# EAGLE design untitled (EAGLE 8.6.3)
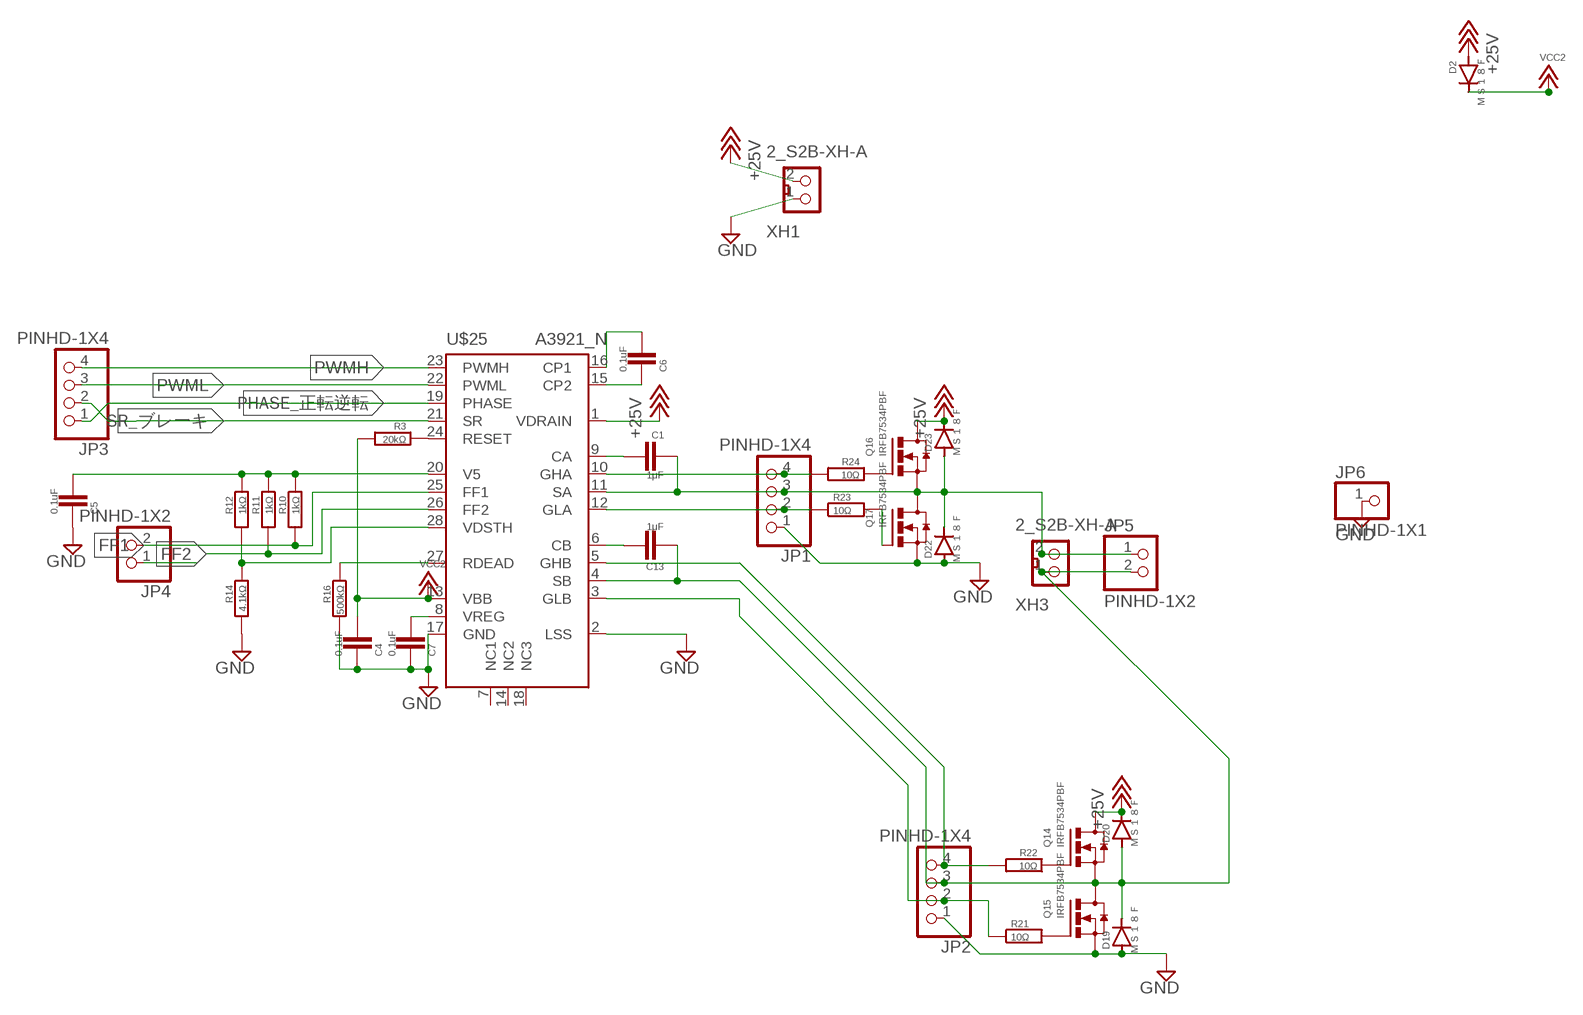
[diagram p0: schematic, sheet 1]

## Parts
C1  1μF  CAPACITOR>>2012  [2012]
C4  0.1uF  CAPACITOR>>2012  [2012]
C5  0.1uF  CAPACITOR>>2012  [2012]
C6  0.1uF  CAPACITOR>>2012  [2012]
C7  0.1uF  CAPACITOR>>2012  [2012]
C13  1μF  CAPACITOR>>2012  [2012]
D2  ＭＳ１８Ｆ  DIODE>>MS18F  [MS18F]
D19  ＭＳ１８Ｆ  DIODE>>MS18F  [MS18F]
D20  ＭＳ１８Ｆ  DIODE>>MS18F  [MS18F]
D22  ＭＳ１８Ｆ  DIODE>>MS18F  [MS18F]
D23  ＭＳ１８Ｆ  DIODE>>MS18F  [MS18F]
JP1  PINHD-1X4  [1X04]
JP2  PINHD-1X4  [1X04]
JP3  PINHD-1X4  [1X04]
JP4  PINHD-1X2  [1X02]
JP5  PINHD-1X2  [1X02]
JP6  PINHD-1X1  [1X01]
Q14  IRFB7534PBF  MOSFET_N>>TO252  [TO252]
Q15  IRFB7534PBF  MOSFET_N>>TO252  [TO252]
Q16  IRFB7534PBF  MOSFET_N>>TO252  [TO252]
Q17  IRFB7534PBF  MOSFET_N>>TO252  [TO252]
R3  20kΩ  REGISTER>>2012  [2012]
R10  1kΩ  REGISTER>>2012  [2012]
R11  1kΩ  REGISTER>>2012  [2012]
R12  1kΩ  REGISTER>>2012  [2012]
R14  4.1kΩ  REGISTER>>2012  [2012]
R16  500kΩ  REGISTER>>2012  [2012]
R21  10Ω  REGISTER>>2012  [2012]
R22  10Ω  REGISTER>>2012  [2012]
R23  10Ω  REGISTER>>2012  [2012]
R24  10Ω  REGISTER>>2012  [2012]
U$25  A3921_N  [TSSOP28_N]
XH1  2_S2B-XH-A  [S2B-XH-A]
XH3  2_S2B-XH-A  [S2B-XH-A]

## Nets
+18V: D2.P$1(A) D20.P$2(C) D23.P$2(C) Q14.3(D) Q16.3(D) U$25.1(VDRAIN) XH1.2 ; supply symbol labelled +25V
FF1: JP4.2 R10.2 U$25.25(FF1)
FF2: JP4.1 R11.2 U$25.26(FF2)
GND: C4.2 C5.2 C7.2 D19.P$1(A) D22.P$1(A) JP1.1 JP2.1 JP6.1 Q15.2(S) Q17.2(S) R14.2 R16.2 U$25.2(LSS) U$25.17(GND) XH1.1
N$4: C6.1 U$25.16(CP1)
N$5: JP2.4 R22.2 U$25.5(GHB)
N$7: C1.2 D22.P$2(C) D23.P$1(A) JP1.3 JP5.1 Q16.2(S) Q17.3(D) U$25.11(SA) XH3.2
N$8: JP2.2 R21.1 U$25.3(GLB)
N$14: C1.1 U$25.9(CA)
N$16: JP1.4 R24.2 U$25.10(GHA)
N$19: C13.2 D19.P$2(C) D20.P$1(A) JP2.3 JP5.2 Q14.2(S) Q15.3(D) U$25.4(SB) XH3.1
N$29: C6.2 U$25.15(CP2)
N$35: JP1.2 R23.1 U$25.12(GLA)
N$36: R3.1 U$25.24(RESET)
N$37: C7.1 U$25.8(VREG)
N$41: C13.1 U$25.6(CB)
N$43: R12.2 R14.1 U$25.28(VDSTH)
N$50: Q15.1(G) R21.2
N$51: R16.1 U$25.27(RDEAD)
N$54: Q14.1(G) R22.1
N$56: Q17.1(G) R23.2
N$60: Q16.1(G) R24.1
PHASE_正転逆転: JP3.1 U$25.19(PHASE)
PWMH: JP3.4 U$25.23(PWMH)
PWML: JP3.3 U$25.22(PWML)
SR_ブレーキ: JP3.2 U$25.21(SR)
V5: C5.1 R10.1 R11.1 R12.1 U$25.20(V5)
VCC2: C4.1 D2.P$2(C) R3.2 U$25.13(VBB)
Unconnected: U$25.7(NC1) U$25.14(NC2) U$25.18(NC3)

## Library data of the parts
C1 C4-C7 C13 = !SMD:CAPACITOR>>
D2 D19 D20 D22 D23 = !diode:DIODE>>: DIODE
JP1-JP3 = !pinhead(ﾋﾟﾝﾍｯﾀﾞ):PINHD-1X4: PIN HEADER
JP4 JP5 = !pinhead(ﾋﾟﾝﾍｯﾀﾞ):PINHD-1X2: PIN HEADER
JP6 = !pinhead(ﾋﾟﾝﾍｯﾀﾞ):PINHD-1X1: PIN HEADER
Q14-Q17 = !FET_transister_v-reg:MOSFET_N>>
R3 R10-R12 R14 R16 R21-R24 = !SMD:REGISTER>>
U$25 = !irs(GateDriver):A3921_N
XH1 XH3 = !con-xh:2_: Wire-to-Board 2.5mm pitch top mount connector Source: http://www.jst-mfg.com/product/pdf/jpn/XH.pdf http://www.jst-mfg.com/product/detail.php?series=277

## Board
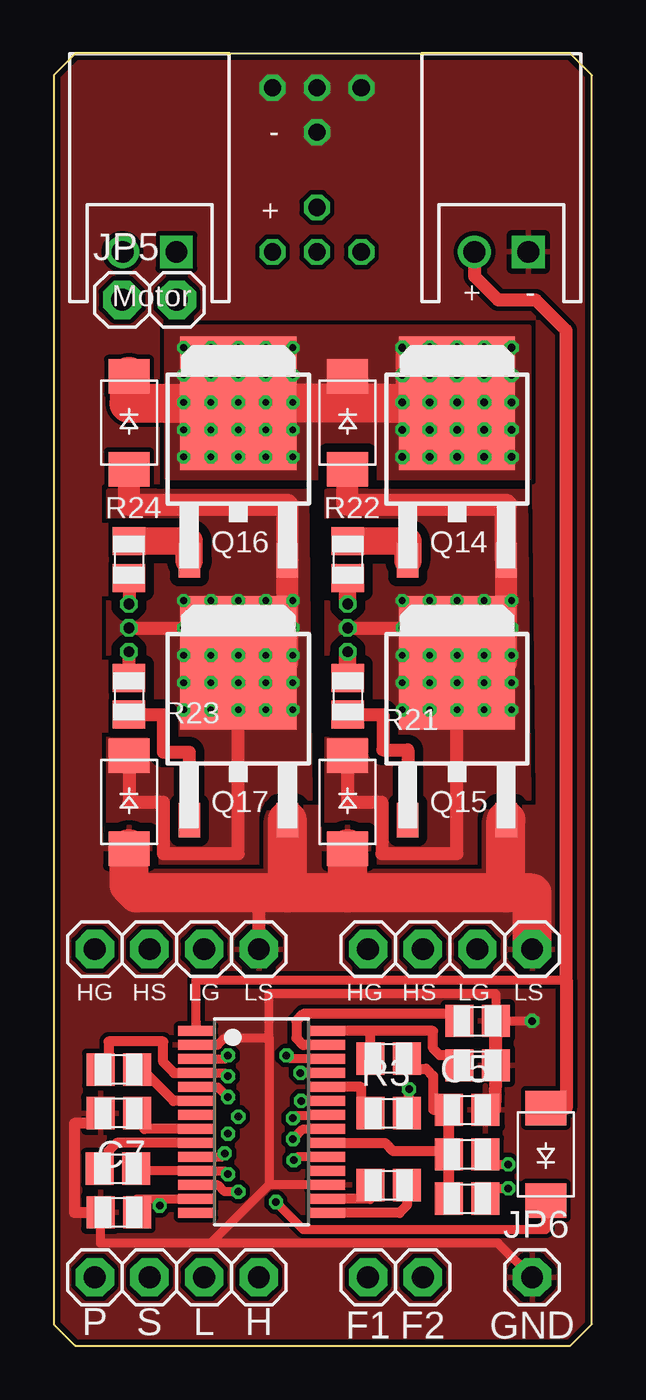
[diagram p1: board, top side]
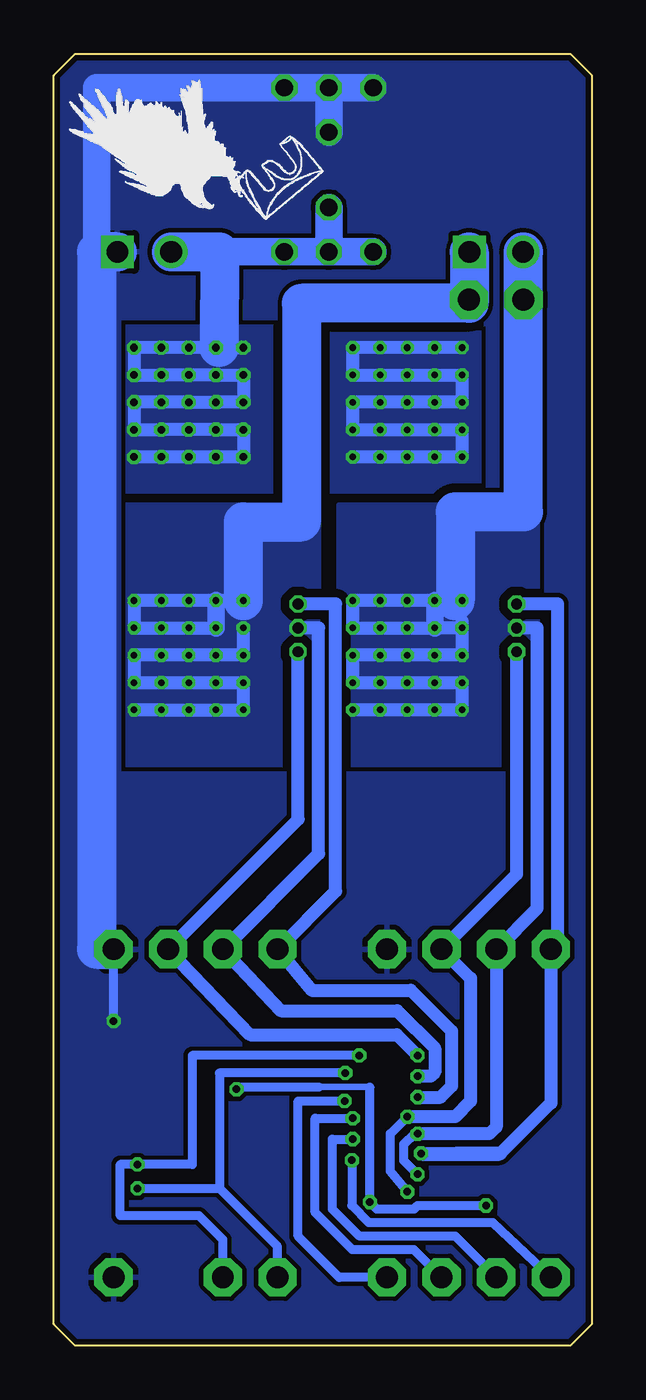
[diagram p2: board, bottom side, seen from below]

Size 25 x 60 mm. Coordinates in mm from the lower left corner, seen from the top.
Outline: 25,1 25,59 24,60 1,60 0,59 0,1 1,0 24,0 25,1
Copper layers (1*16): Top 0.035mm / dielectric 1.5mm / Bottom 0.035mm
Design rules "SeeedStudio_2layer_DRU_no_angle_20140221": minimum track width 6mil, minimum drill 12mil, track to track 6mil, track to pad 6mil, pad to pad 6mil, via to via 6mil, smd to smd 0mil, copper to edge 10mil, drill to drill 10mil, minimum pad ring 10mil, minimum via ring 6mil, stop-mask expansion 2mil, vias tented up to drill 100mil, thermal gap 10mil

### Footprints (pad centres in the part's own frame; a part is rotated, then mirrored left to right if it is on the bottom)
2012 = smd 1.3 x 1.5: 1 -0.85,0; 2 0.85,0
MS18F = smd 1.6 x 1.9: P$1 -2.15,0; P$2 2.15,0
1X04 = drill 1.016 pad 1.778 octagon: 1 -3.81,0; 2 -1.27,0; 3 1.27,0; 4 3.81,0
1X02 = drill 1.016 pad 1.778 octagon: 1 -1.27,0; 2 1.27,0
1X01 = drill 1.016 pad 1.778 octagon: 1 0,0
TO252 = smd 1 x 1.6: 1 -2.28,-4.8; 2 2.28,-4.8 | smd 5.4 x 6.2: 3 0,2.5
TSSOP28_N = smd 0.45 x 1.65: 1 -4.225,-3.05; 2 -3.575,-3.05; 3 -2.925,-3.05; 4 -2.275,-3.05; 5 -1.625,-3.05; 6 -0.975,-3.05; 7 -0.325,-3.05; 8 0.325,-3.05; 9 0.975,-3.05; 10 1.625,-3.05; 11 2.275,-3.05; 12 2.925,-3.05; 13 3.575,-3.05; 14 4.225,-3.05; 15 4.225,3.05; 16 3.575,3.05; 17 2.925,3.05; 18 2.275,3.05; 19 1.625,3.05; 20 0.975,3.05; 21 0.325,3.05; 22 -0.325,3.05; 23 -0.975,3.05; 24 -1.625,3.05; 25 -2.275,3.05; 26 -2.925,3.05; 27 -3.575,3.05; 28 -4.225,3.05
S2B-XH-A = drill 1.016 square: 1 1.25,0 | drill 1.016: 2 -1.25,0

### Placement (x,y rotation side)
C1  2.98,8.22 0 top
C4  3.02,6.19 180 top
C5  19.21,10.95 0 top
C6  15.56,7.46 0 top
C7  3.02,10.79 180 top
C13  3.02,12.83 180 top
D2  22.86,8.89 270 top
D19  13.65,25.24 90 top
D20  13.65,42.86 90 top
D22  3.49,25.24 90 top
D23  3.49,42.86 90 top
JP1  5.71,18.41 180 top
JP2  18.42,18.41 180 top
JP3  5.71,3.17 0 top
JP4  15.88,3.17 180 top
JP5  4.45,48.58 0 top
JP6  22.23,3.17 0 top
Q14  18.73,41.27 0 top
Q15  18.73,29.21 0 top
Q16  8.57,41.27 0 top
Q17  8.57,29.21 0 top
R3  15.56,10.79 0 top
R10  19.21,6.83 0 top
R11  19.21,8.89 0 top
R12  15.56,13.34 180 top
R14  19.69,13.02 0 top
R16  19.69,15.08 0 top
R21  13.65,30.16 270 top
R22  13.65,36.51 270 top
R23  3.49,30.16 270 top
R24  3.49,36.51 270 top
U$25  9.66,10.39 270 top
XH1  20.8,50.8 0 top
XH3  4.45,50.8 0 top

### Tracks (layer width: path | path; a pad name or v marks a point on that pad's centre or on a via)
+18V  (via drill 0.3, 0.35, 0.8)
  Top 0.406: 23.81,16.99 6.61,16.99 U$25.1 6.61,15.08
  Top 0.61: Q16.3 v8.57,42.55 | Q14.3 16.19,43.77 v16.19,46.36 | D2.P$1 23.81,11.04 23.81,16.99 23.81,47.15 22.38,48.58 20.64,48.58 19.55,49.67 XH1.2
  Top 1.27: 15.56,43.77 13.65,43.77 D20.P$2 | v8.57,45.09 Q16.3 8.28,44.41
  Top 1.8: Q14.3 15.56,43.77 Q16.3 3.49,43.77 D23.P$2
  Bottom 0.61: v6.03,46.36 v7.3,46.36 v8.57,46.36 v9.84,46.36 v11.11,46.36 v11.11,45.09 v9.84,45.09 v8.57,45.09 v7.3,45.09 v6.03,45.09 v6.03,43.82 v7.3,43.82 | 7.14,43.82 v8.57,43.82 v9.84,43.82 v11.11,43.82 v11.11,42.55 v9.84,42.55 v8.57,42.55 v7.3,42.55 v6.03,42.55 v6.03,41.27 v7.3,41.27 v8.57,41.27 v9.84,41.27 v11.11,41.27 | 17.3,46.36 v16.19,46.36 | v17.46,46.36 v18.73,46.36 v20,46.36 v21.27,46.36 v21.27,45.09 v20,45.09 v18.73,45.09 v17.46,45.09 | 17.3,45.09 v16.19,45.09 v16.19,43.82 17.3,43.82 | v17.46,43.82 v18.73,43.82 v20,43.82 v21.27,43.82 v21.27,42.55 v20,42.55 v18.73,42.55 v17.46,42.55 | 17.3,42.55 v16.19,42.55 v16.19,41.27 17.3,41.27 | v17.46,41.27 v18.73,41.27 v20,41.27 v21.27,41.27
  Bottom 1.27: v10.16,50.8 v12.22,50.8 | v12.22,50.8 v14.29,50.8 17.3,50.8 | v12.22,52.86 v12.22,50.8
  Bottom 1.8: XH1.2 17.3,50.8 17.32,46.36 17.3,46.36
  pour Top (isolate 0.406, rank 2, no thermals): 22.07,47.31 5.24,47.31 5.24,40.32 22.07,40.32
  pour Bottom (isolate 0.406, rank 2, no thermals): 5.24,47.31 22.07,47.31 22.07,39.69 5.24,39.69
FF1  (via drill 0.35)
  Top 0.406: R10.2 20.06,7.3 v21.11,7.3
  Top 0.457: U$25.25 v11.46,12.67
  Bottom 0.406: v11.46,12.67 17.3,12.67 17.3,7.3 | v21.11,7.3 17.3,7.3 | JP4.2 14.61,4.6 17.3,7.3
FF2  (via drill 0.35)
  Top 0.406: R11.2 20.06,8.41 v21.11,8.41 | v10.81,13.48 10.94,13.35 12.68,13.35 U$25.26
  Bottom 0.406: JP4.1 17.15,4.92 18.26,6.03 21.91,6.03 21.91,8.41 v21.11,8.41 18.57,8.41 18.57,13.48 v10.81,13.48
GND  (via drill 0.35, 0.8)
  Top 0.406: U$25.17 10,7.47 | U$25.2 7.62,13.97 7.94,14.29 10,14.29 | 10,14.29 10,7.47 | C4.2 2.17,4.76 7.29,4.76 | 10,14.29 10,16.35 20.54,16.35 20.54,14.61 | R16.2 v22.23,15.08 | 10,7.47 7.29,4.76 | JP6.1 20.64,4.76 7.29,4.76
  Top 0.508: 2.17,10.64 C7.2 1.75,10.79 1.75,10.32 0.95,10.32 0.95,6.19 C4.2
  Top 0.61: C5.2 20.48,10.95 R14.2 20.54,14.61 R16.2 | JP1.1 9.53,20.97 10.85,21.03
  Top 1.27: 21.01,20.95 21.01,21.03
  Top 1.8: 21.01,21.03 13.65,21.03 | 13.65,21.11 D19.P$1 13.65,21.03 | 13.65,21.03 10.85,21.03 | D22.P$1 3.49,21.4 3.87,21.03 10.85,21.03 | 21.01,21.03 Q15.2 | 10.85,21.03 Q17.2 | JP2.1 22.23,21.03 21.01,21.03
  Bottom 0.406: v22.23,15.08 22.23,17.62 23.02,18.41
  Bottom 1.27: v10.16,58.42 v12.22,58.42 | v12.22,58.42 v14.29,58.42 23.02,58.42 23.02,50.8 | v12.22,58.42 v12.22,56.36
  Bottom 1.8: XH1.1 23.02,50.8 23.02,18.41 JP2.1
  pour Bottom (isolate 0.203, rank 6): 25,1 24,0 1,0 0,1 0,59 1,60 24,60 25,59
  pour Top (isolate 0.203, rank 6): 25,1 24,0 1,0 0,1 0,59 1,60 24,60 25,59
N$4
  Top 0.457: C6.1 14.71,6.82 U$25.16
N$5  (via drill 0.35, 0.5)
  Top 0.406: U$25.5 7.62,12.02 v8.1,11.54
  Top 0.813: R22.2 v13.65,34.45
  Bottom 0.61: v13.65,34.45 11.91,34.45 11.91,21.11 JP2.4 13.02,16.51 8.41,16.51 6.51,14.61 6.51,12.06 7.03,11.54 v8.1,11.54
N$7  (via drill 0.3, 0.35, 0.5)
  Top 0.406: 3.83,8.12 U$25.11 7.94,8.12 v8.1,7.96
  Top 0.457: 3.83,8.12 C1.2
  Top 0.61: 8.57,29.69 8.57,22.86 5.08,22.86 5.08,25.24 3.49,25.24 D22.P$2 | Q17.3 8.57,33.18 | v3.49,33.34 v6.03,33.34
  Top 0.813: 8.57,29.69 Q17.3
  Top 1.016: Q16.2 10.85,31.71 Q17.3 | 10.85,36.51 Q16.2 | Q16.2 10.85,39.05 3.49,39.05 D23.P$1
  Bottom 0.406: v8.1,7.96 8.73,8.6 8.73,9.37 8.26,9.84 v8.1,9.84 | JP5.1 3.17,50.8
  Bottom 0.508: v8.1,9.84 5.4,9.84
  Bottom 0.61: v3.49,33.34 2.54,33.34 2.54,20.32 JP1.3 4.45,10.16 4.76,9.84 v8.1,9.84 | v6.03,34.61 v7.3,34.61 v8.57,34.61 v9.84,34.61 v11.11,34.61 v11.11,33.34 v9.84,33.34 v8.57,33.34 v7.3,33.34 v6.03,33.34 | v11.11,29.53 v9.84,29.53 v8.57,29.53 v7.3,29.53 v6.03,29.53 v6.03,30.8 v7.3,30.8 v8.57,30.8 v9.84,30.8 v11.11,30.8 v11.11,32.07 v9.84,32.07 v8.57,32.07 v7.3,32.07 v6.03,32.07 v6.03,33.34 | 6.03,33.66 v6.03,33.34
  Bottom 0.813: v7.3,33.34 v7.3,34.61
  Bottom 1.8: 6.35,34.61 6.35,38.73 3.17,38.73 3.17,50.8 XH3.2
  pour Top (isolate 0.406, rank 3, no thermals): 2.54,39.69 2.54,22.22 9.68,22.22 9.68,25.4 11.91,25.4 11.75,39.69
  pour Bottom (isolate 0.406, rank 3, no thermals): 2.54,26.99 2.54,39.05 11.75,39.05 11.75,26.99
N$8  (via drill 0.35, 0.5)
  Top 0.406: U$25.3 7.94,13.32 v8.1,13.48
  Top 0.813: R21.1 v13.65,32.23
  Bottom 0.61: v13.65,32.23 13.65,24.45 JP2.2 15.88,14.45 9.06,14.45 v8.1,13.48
N$14
  Top 0.457: C1.1 2.54,8.22 2.54,9.05 2.91,9.42 U$25.9
N$16  (via drill 0.35, 0.5)
  Top 0.406: U$25.10 7.78,8.77 v7.94,8.93
  Top 0.61: R24.2 v3.49,34.45
  Bottom 0.508: v7.94,8.93 6.35,8.93 5.2,8.93
  Bottom 0.61: v3.49,34.45 1.59,34.45 1.59,18.73 JP1.4 1.91,11.27 4.25,8.93 | 4.25,8.93 4.29,8.89 | 4.29,8.89 4.32,8.93 6.35,8.93 | 4.29,8.89 7.9,8.89 v7.94,8.93 4.25,8.93
N$19  (via drill 0.3, 0.35, 0.5)
  Top 0.406: U$25.4 7.94,12.67 v8.1,12.51
  Top 0.457: C13.2 2.54,12.83 2.54,14.13 5.08,14.13 5.08,13.18 5.59,12.67 U$25.4
  Top 0.61: Q15.3 19.69,33.34 | 18.73,29.37 18.73,22.86 15.24,22.86 15.24,25.24 13.65,25.24 D19.P$2 | v13.65,33.34 v16.19,33.34
  Top 0.813: 18.73,29.37 Q15.3
  Top 1.016: 21.01,36.51 Q14.2 | Q14.2 21.01,31.71 Q15.3 | D20.P$1 13.65,39.05 21.01,39.05 Q14.2
  Bottom 0.406: JP5.2 5.71,50.78 XH3.1
  Bottom 0.61: v17.46,29.53 v20,29.53 v21.27,29.53 | v18.73,29.53 v17.46,29.53 | v17.46,29.53 v16.19,29.53 v16.19,30.8 v17.46,30.8 v18.73,30.8 v20,30.8 v21.27,30.8 v21.27,32.07 v20,32.07 v18.73,32.07 v17.46,32.07 v16.19,32.07 v16.19,33.34 | v13.65,33.34 12.7,33.34 12.7,22.86 JP2.3 14.45,15.56 9.05,15.56 7.3,13.81 7.3,12.7 7.49,12.51 v8.1,12.51 | v16.19,34.61 v17.46,34.61 v18.73,34.61 v20,34.61 v21.27,34.61 v21.27,33.34 v20,33.34 v18.73,33.34 v17.46,33.34
  Bottom 0.813: v17.46,34.61 v17.46,33.34
  Bottom 1.8: v16.19,34.61 16.19,38.26 13.49,38.26 13.49,48.42 5.69,48.42 XH3.1
  pour Top (isolate 0.406, rank 3, no thermals): 12.7,22.22 19.84,22.22 19.84,25.4 22.07,25.4 21.91,39.69 12.7,39.69
  pour Bottom (isolate 0.406, rank 3, no thermals): 12.7,39.05 21.91,39.05 21.91,26.99 12.7,26.99
N$29
  Top 0.457: C6.2 16.41,6.51 16.07,6.17 U$25.15
N$35  (via drill 0.35, 0.5)
  Top 0.406: U$25.12 7.62,7.47 7.94,7.15 v8.57,7.15
  Top 0.61: 3.49,31.11 R23.1 v3.49,32.23
  Bottom 0.406: v8.57,7.15 9.37,8.1 9.37,9.84 v8.57,10.64
  Bottom 0.61: v8.57,10.64 6.35,10.64 5.64,11.35 5.64,17.07 JP1.2 3.49,21.91 v3.49,32.23
N$36
  Top 0.457: R3.1 14.29,10.79 14.29,12.02 U$25.24
N$37
  Top 0.457: U$25.8 4.22,10.07 4.21,10.56 4.1,10.56 C7.1
N$41
  Top 0.457: U$25.6 5.56,11.37 4.1,12.83 C13.1
N$43
  Top 0.457: 14.71,14.62 U$25.28 | 14.71,14.62 17.62,14.62 17.62,13.81 17.94,13.49 18.84,13.49 R14.1 | R12.2 14.71,14.62
N$50
  Top 0.61: R21.2 15.29,29.31 15.29,27.67 16.45,27.67 Q15.1
N$51
  Top 0.457: U$25.27 11.59,13.97 11.27,14.29 11.27,15.08 11.59,15.4 18.84,15.4 R16.1
N$54
  Top 1.27: R22.1 16.45,37.36 Q14.1
N$56
  Top 0.61: Q17.1 6.29,27.57 5.08,27.57 5.08,29.31 R23.2
N$60
  Top 1.27: Q16.1 6.29,37.36 R24.1
PHASE_正転逆転  (via drill 0.35)
  Top 0.406: U$25.19 11.31,8.77 v11.15,8.61
  Bottom 0.406: v11.15,8.61 11.15,6.51 10.36,5.71 4.6,5.71 JP3.1
PWMH  (via drill 0.35)
  Top 0.457: U$25.23 v11.49,11.37
  Bottom 0.406: v11.49,11.37 13.65,11.37 13.65,5.08 11.75,3.17 JP3.4
  Bottom 0.457: v11.49,11.37 11.51,11.35
PWML  (via drill 0.35)
  Top 0.406: v11.11,10.56 11.24,10.69 12.68,10.69 U$25.22
  Bottom 0.406: v11.11,10.56 12.86,10.56 12.86,6.19 11.13,4.46 8.27,4.46 JP3.3
SR_ブレーキ  (via drill 0.35)
  Top 0.406: v11.11,9.59 11.59,10.07 U$25.21
  Bottom 0.406: v11.11,9.59 12.06,9.59 12.06,6.35 10.79,5.08 6.35,5.08 JP3.2
V5
  Top 0.457: U$25.20 15.4,9.42 15.77,9.05 18.36,9.05 | C5.1 17.62,10.95 17.62,12.54 17.3,12.86 16.41,12.86 R12.1
  Top 0.508: R10.1 R11.1 18.36,9.05 C5.1
VCC2  (via drill 0.35)
  Top 0.34: 6.67,6.82 6.35,6.82
  Top 0.406: C4.1 3.87,6.82 4.92,6.82 | 4.92,6.82 6.35,6.82 U$25.13 | v4.92,6.51 4.92,6.82 | D2.P$2 22.86,5.4 11.59,5.4 v10.32,6.67
  Top 0.457: C4.1 4.13,6.35 | R3.2 16.51,10.79 v16.51,11.91
  Bottom 0.305: 12.7,12.02 10.32,12.02
  Bottom 0.406: v16.51,11.91 16.51,12.02 12.7,12.02 | v4.92,6.51 8.1,6.51 8.26,6.35 10,6.35 v10.32,6.67 10.32,11.43 10.32,11.97 10.32,12.02

### Text on the board
tNames: - | + | Motor | + | - | HG | HS | LG | LS | HG | HS | LG | LS | P | S | L | H | F1 | F2 | GND